# Altium schematic sheet RS485.SchDoc
size A3
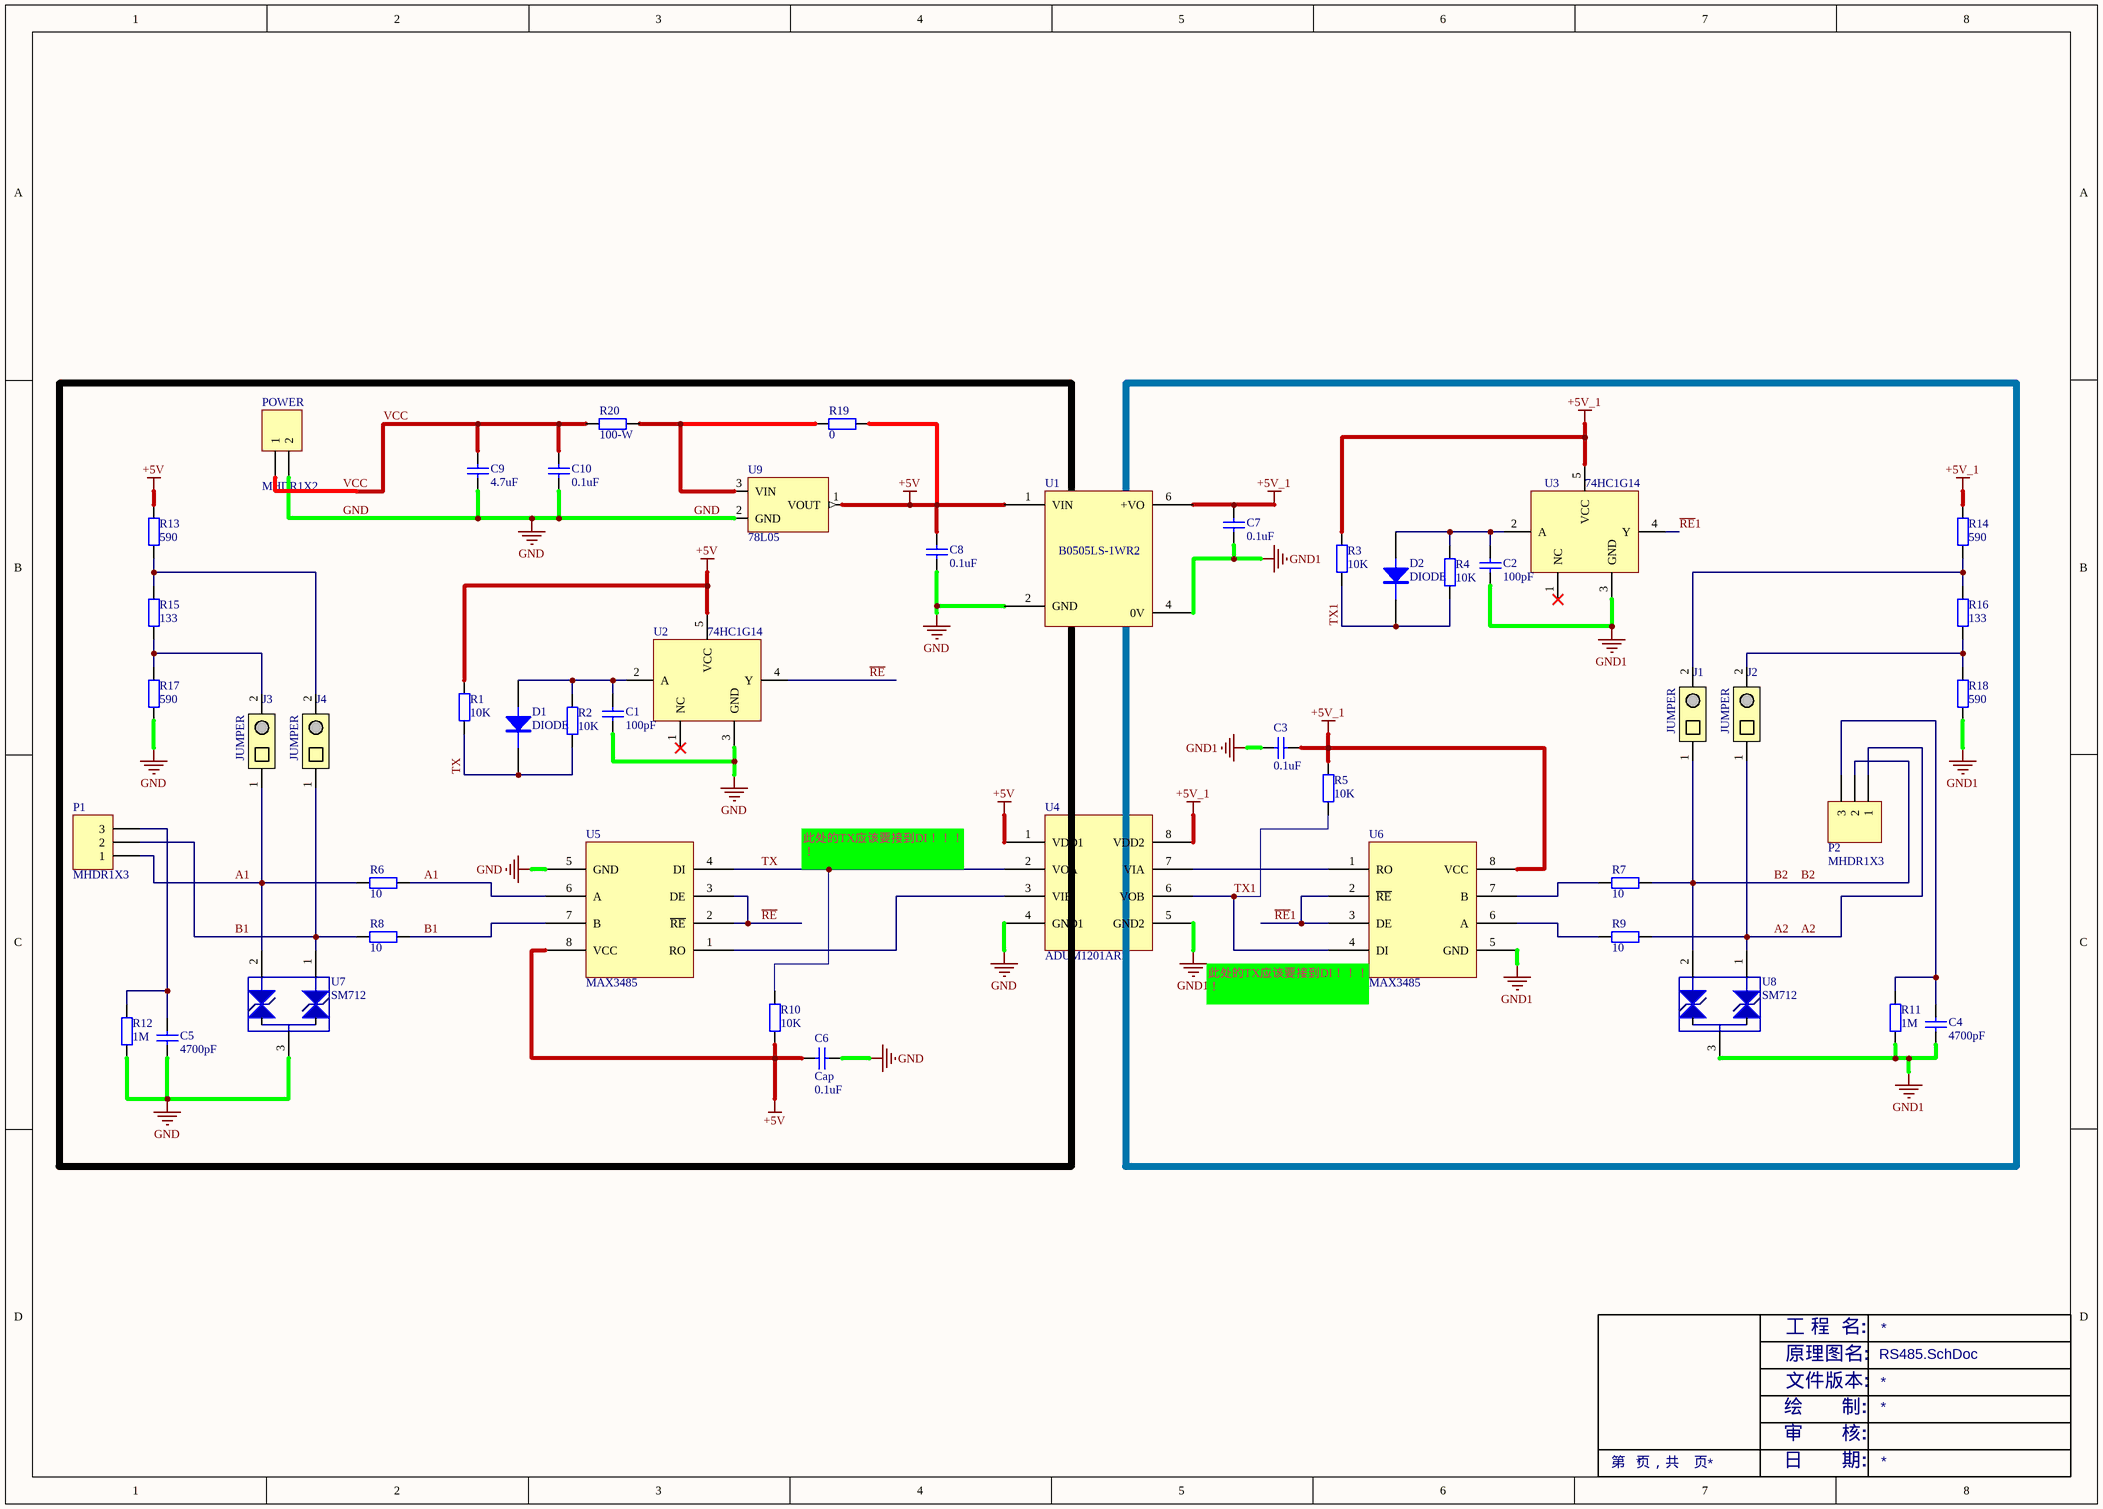
[diagram p0: RS485.SchDoc]

## Parts
C1  100pF  [CC0603]
C2  100pF  [CC0603]
C3  0.1uF  [CC0603]
C4  4700pF  [CC0603]
C5  4700pF  [CC0603]
C6  Cap  value 0.1uF  [CC0603]
C7  0.1uF  [CC0603]
C8  0.1uF  [CC0603]
C9  4.7uF  [CC0603]
C10  0.1uF  [CC0603]
D1  DIODE  [SOD323]
D2  DIODE  [SOD323]
J1  JUMPER  [SIP2-2.54MM]
J2  JUMPER  [SIP2-2.54MM]
J3  JUMPER  [SIP2-2.54MM]
J4  JUMPER  [SIP2-2.54MM]
P1  MHDR1X3  [HEADER_35MM]
P2  MHDR1X3  [HEADER_35MM]
POWER  MHDR1X2  [HEADER_35MM_2]
R1  10K  [CC0603]
R2  10K  [CC0603]
R3  10K  [CC0603]
R4  10K  [CC0603]
R5  10K  [CC0603]
R6  10  [CC0603]
R7  10  [CC0603]
R8  10  [CC0603]
R9  10  [CC0603]
R10  10K  [CC0603]
R11  1M  [CC0603]
R12  1M  [CC0603]
R13  590  [CC0603]
R14  590  [CC0603]
R15  133  [CC0603]
R16  133  [CC0603]
R17  590  [CC0603]
R18  590  [CC0603]
R19  0  [CC0603]
R20  100-W  [AXIAL-0.3]
U1  B0505LS-1WR2  [B0505LS-1WR2]
U2  74HC1G14  [SOT-23-5]
U3  74HC1G14  [SOT-23-5]
U4  ADUM1201ARZ  [SO-8]
U5  MAX3485  [SO-8]
U6  MAX3485  [SO-8]
U7  SM712  [SOT-23W]
U8  SM712  [SOT-23W]
U9  78L05  [SOT-89]

## Nets
+5V: C6.1 C8.1 R1.2 R10.2 R13.2 R19.1 U1.1(VIN) U2.5(VCC) U4.1(VDD1) U5.8(VCC) U9.1(VOUT)
+5V_1: C3.1 C7.1 R3.2 R5.2 R14.2 U1.6(+VO) U3.5(VCC) U4.8(VDD2) U6.8(VCC)
GND: C1.1 C5.1 C6.2 C8.2 C9.2 C10.2 POWER.2 R12.2 R17.1 U1.2(GND) U2.3(GND) U4.4(GND1) U5.5(GND) U7.3 U9.2(GND)
GND1: C2.1 C3.2 C4.1 C7.2 R11.2 R18.1 U1.4(0V) U3.3(GND) U4.5(GND2) U6.5(GND) U8.3
~{RE}: U2.4(Y) U5.2(~{RE}) U5.3(DE)
~{RE}1: U3.4(Y) U6.2(~{RE}) U6.3(DE)
A1: J3.1 P1.1 R6.1 R6.2 U5.6(A) U7.2
A2: J2.1 P2.1 R9.1 U8.1
B1: J4.1 P1.2 R8.1 R8.2 U5.7(B) U7.1
B2: J1.1 P2.2 R7.1 U8.2
TX: D1.2(K) R1.1 R2.1 R10.1 U4.2(VOA) U5.4(DI)
TX1: D2.2(K) R3.1 R4.1 R5.1 U4.6(VOB) U6.4(DI)
VCC: C9.1 C10.1 POWER.1 R20.2
NetC1_2: C1.2 D1.1(A) R2.2 U2.2(A)
NetC2_2: C2.2 D2.1(A) R4.2 U3.2(A)
NetC4_2: C4.2 P2.3 R11.1
NetC5_2: C5.2 P1.3 R12.1
NetJ1_2: J1.2 R14.1 R16.2
NetJ2_2: J2.2 R16.1 R18.2
NetJ3_2: J3.2 R15.1 R17.2
NetJ4_2: J4.2 R13.1 R15.2
NetR7_2: R7.2 U6.7(B)
NetR9_2: R9.2 U6.6(A)
NetR19_2: R19.2 R20.1 U9.3(VIN)
NetU4_3: U4.3(VIB) U5.1(RO)
NetU4_7: U4.7(VIA) U6.1(RO)

Not connected (* = marked no-connect by the designer): U2 1(NC)*; U3 1(NC)*

## Notes on the sheet
- 此处的TX应该要接到DI！！！！
- (near U6) 此处的TX应该要接到DI！！！！
- 文件版本:
- 原理图名:
- 工 程  名:
- 绘       制:
- 审       核:
- 第   页，共    页
- 日       期:

## Library data of the parts
C1-C8 C10 = Cap: Capacitor; Published: 8-Jun-2000; LatestRevisionDate: 17-Jul-2002; LatestRevisionNote: Re-released for DXP Platform.; PackageReference: RAD-0.3; Publisher: Altium Limited; PackageDescription: Radial Cap, Thru-Hole; 2 Leads; 0.3 in Pin Spacing
  C1 C2: Value: 100pF
  C3 C7 C8 C10: Value: 0.1uF
  C4 C5: Value: 4700pF
C9 = Cap: Capacitor; Value: 0.1uF; Published: 8-Jun-2000; LatestRevisionDate: 17-Jul-2002; LatestRevisionNote: Re-released for DXP Platform.; PackageReference: RAD-0.3; Publisher: Altium Limited; PackageDescription: Radial Cap, Thru-Hole; 2 Leads; 0.3 in Pin Spacing
P1 P2 = MHDR1X3: Header, 3-Pin; LatestRevisionDate: 17-Jul-2002; LatestRevisionNote: Re-released for DXP Platform.; Publisher: Altium Limited
POWER = MHDR1X2: Header, 2-Pin; LatestRevisionDate: 17-Jul-2002; LatestRevisionNote: Re-released for DXP Platform.; Publisher: Altium Limited
R1-R12 = Res2: Resistor; Published: 8-Jun-2000; LatestRevisionDate: 17-Jul-2002; LatestRevisionNote: Re-released for DXP Platform.; PackageReference: AXIAL-0.4; Publisher: Altium Limited; PackageDescription: Axial Device, Thru-Hole; 2 Leads; 0.4 in Pin Spacing
  R1-R5 R10: Value: 10K
  R6-R9: Value: 10
  R11 R12: Value: 1M
R13-R20 = Res2: Resistor; Value: 10; Published: 8-Jun-2000; LatestRevisionDate: 17-Jul-2002; LatestRevisionNote: Re-released for DXP Platform.; PackageReference: AXIAL-0.4; Publisher: Altium Limited; PackageDescription: Axial Device, Thru-Hole; 2 Leads; 0.4 in Pin Spacing
U9 = 78L05: CI-78L05